# EAGLE design csa_pwr-v1.1c (EAGLE 5.11)
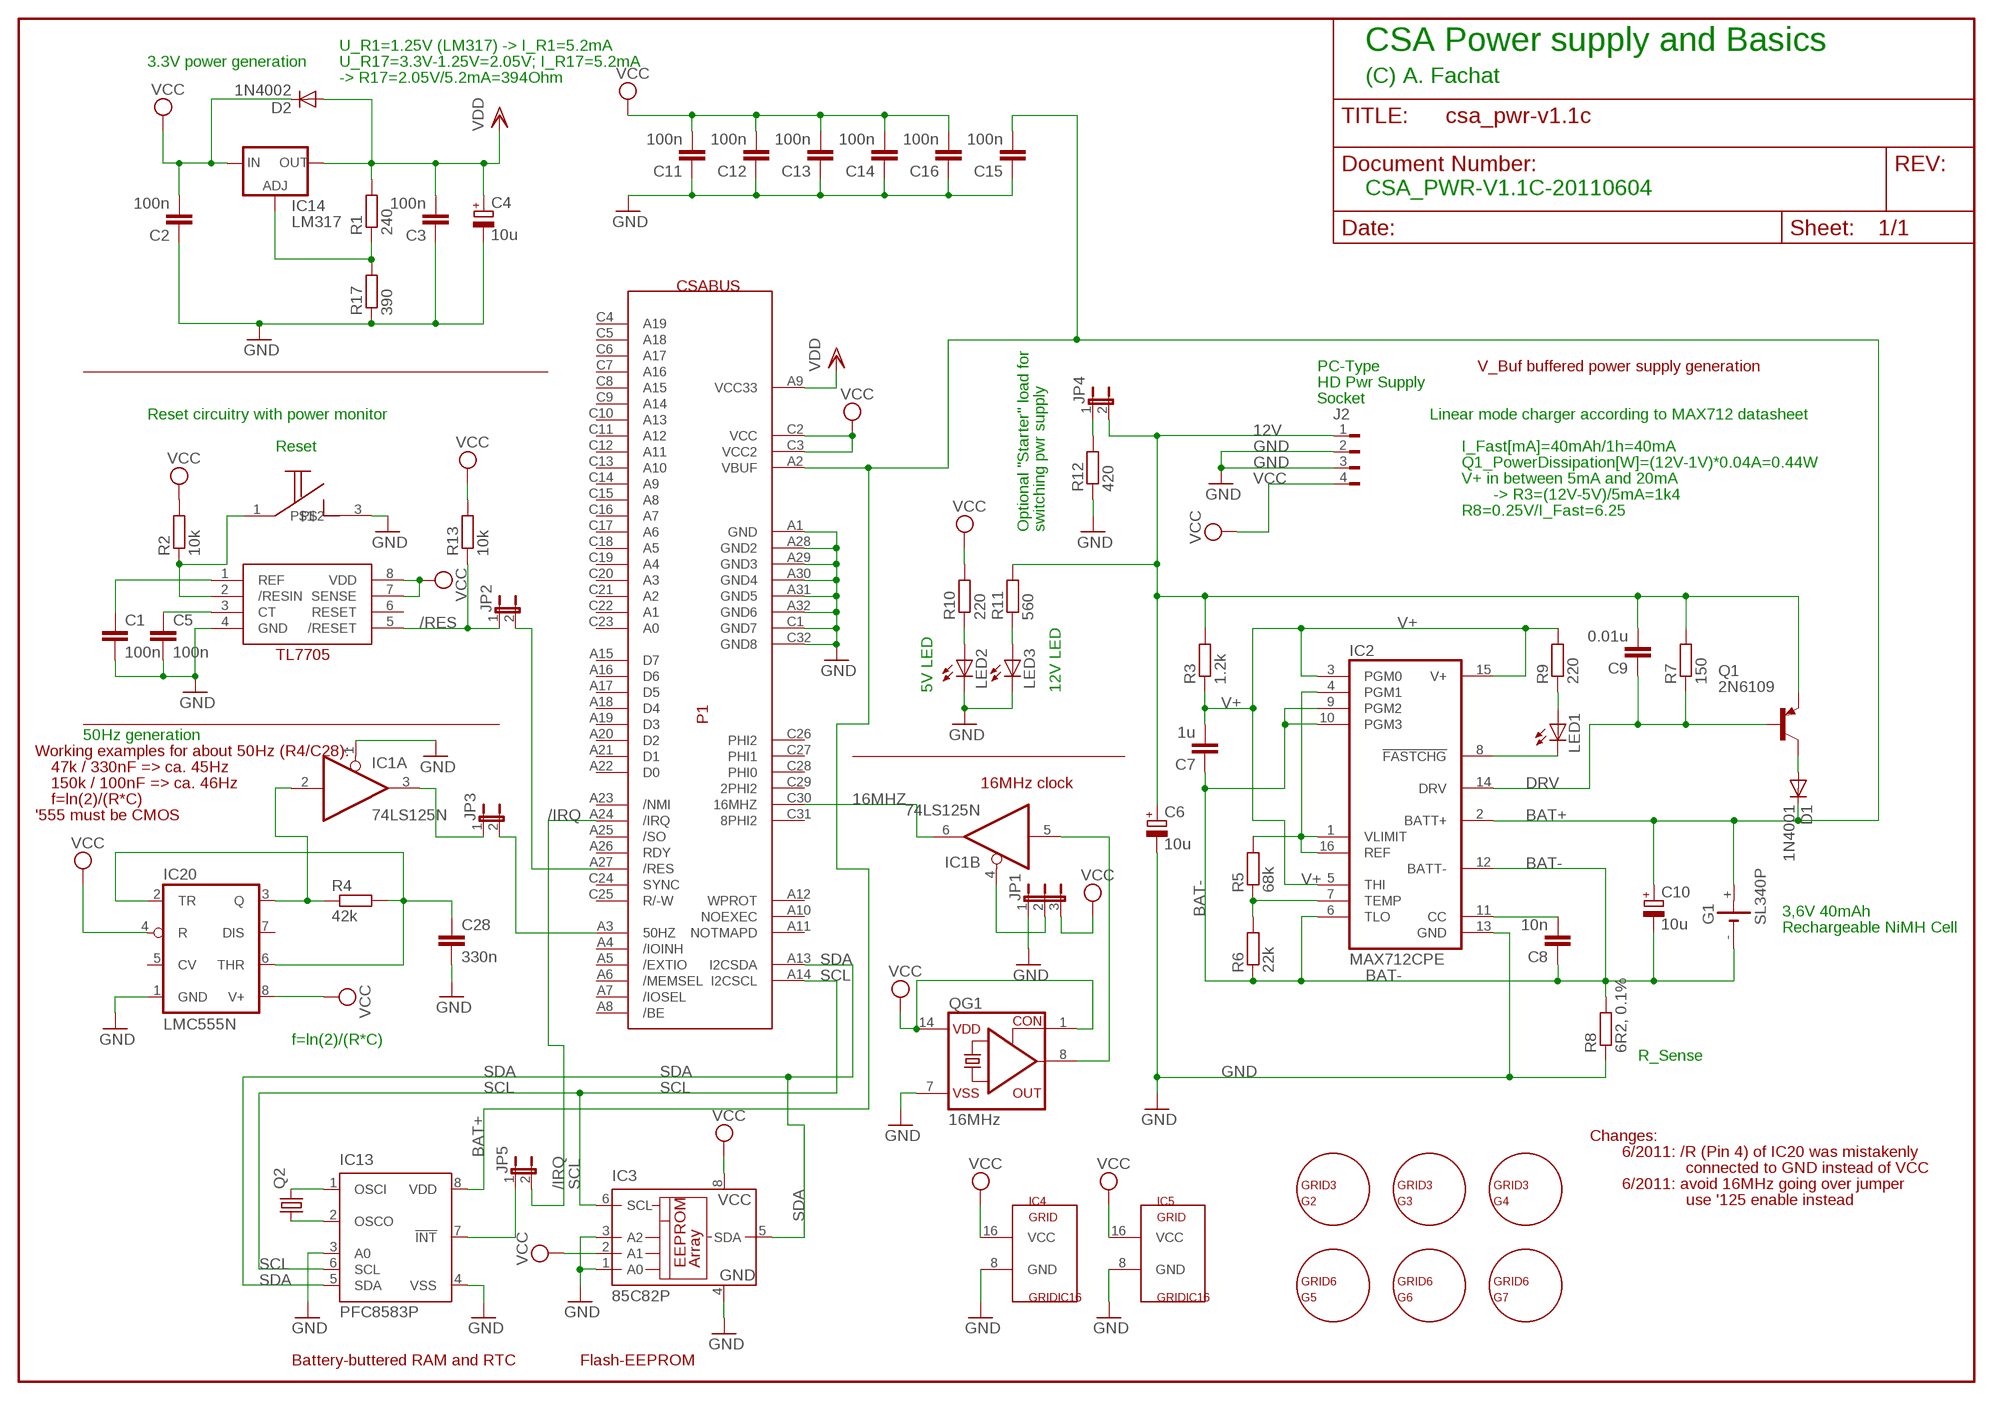
[diagram p0: schematic, sheet 1]

## Parts
C1  100n  C-EU025-025X050  [C025-025X050]
C2  100n  C5/2.5  [C5B2.5]
C3  100n  C5/2.5  [C5B2.5]
C4  10u  CPOL-EUE2-5  [E2-5]
C5  100n  C-EU025-025X050  [C025-025X050]
C6  10u  CPOL-EUE2-5  [E2-5]
C7  1u  C5/2.5  [C5B2.5]
C8  10n  C5/2.5  [C5B2.5]
C9  0.01u  C5/2.5  [C5B2.5]
C10  10u  CPOL-EUE2-5  [E2-5]
C11  100n  C5/2.5  [C5B2.5]
C12  100n  C5/2.5  [C5B2.5]
C13  100n  C5/2.5  [C5B2.5]
C14  100n  C5/2.5  [C5B2.5]
C15  100n  C5/2.5  [C5B2.5]
C16  100n  C5/2.5  [C5B2.5]
C28  330n  C-EU050-025X075  [C050-025X075]
D1  1N4001  DIODE-C1702-15  [C1702-15]
D2  1N4002  DIODE-C1702-15  [C1702-15]
G1  SL340P  [SL-340/P3.6V]
G2  GRID3  [GRID3]
G3  GRID3  [GRID3]
G4  GRID3  [GRID3]
G5  GRID6  [GRID6]
G6  GRID6  [GRID6]
G7  GRID6  [GRID6]
IC1  74LS125N  [DIL14]
IC2  MAX712CPE  [DIL16]
IC3  85C82P  [DIL8]
IC4  GRIDIC16  [GRIDIC8]
IC5  GRIDIC16  [GRIDIC8]
IC13  PFC8583P  [DIL08]
IC14  LM317  LM317TL  [317TL]
IC20  LMC555N  LM555N  [DIL08]
J2  FLOP-4W827001  [827001]
JP1  JP2E  [JP2]
JP2  JP1E  [JP1]
JP3  JP1E  [JP1]
JP4  JP1E  [JP1]
JP5  JP1E  [JP1]
LED1  LED3MM  [LED3MM]
LED2  LED3MM  [LED3MM]
LED3  LED3MM  [LED3MM]
P1  CSABUS  [CSABUS]
Q1  2N6109  2N6107  [TO220]
Q2  CRYTALHC49S  [HC49/S]
QG1  16MHz  CRYSTAL_RES-SG51  [SG51]
R1  240  R-EU_0204/5  [0204/5]
R2  10k  R-EU_0207/10  [0207/10]
R3  1.2k  R-EU_0204/5  [0204/5]
R4  42k  R-EU_0204/7  [0204/7]
R5  68k  R-EU_0204/5  [0204/5]
R6  22k  R-EU_0204/5  [0204/5]
R7  150  R-EU_0204/5  [0204/5]
R8  6R2, 0.1%  R-EU_0204/5  [0204/5]
R9  220  R-EU_0204/5  [0204/5]
R10  220  R-EU_0204/5  [0204/5]
R11  560  R-EU_0204/5  [0204/5]
R12  420  R-EU_RDH/15  [RDH/15]
R13  10k  R-EU_0207/10  [0207/10]
R17  390  R-EU_0204/5  [0204/5]
U$1  TL7705  [DIL08]
U$2  TASTER  [TASTER]

## Nets
12V: C6.+ C9.2 J2.1 JP4.2 Q1.3(E) R3.2 R7.2 R11.2
16MHZ: IC1.6(B:O) P1.C30(16MHZ)
/IRQ: JP5.2 P1.A24(/IRQ)
/RES: JP2.1 R13.1 U$1.5(/RESET)
BAT+: C10.+ C15.2 D1.C G1.+ IC2.2(BATT+) IC13.8(VDD) P1.A2(VBUF)
BAT-: C7.1 C8.1 C10.- G1.- IC2.6(TLO) IC2.9(PGM2) IC2.10(PGM3) IC2.12(BATT-) R6.1 R8.2
DRV: C9.1 IC2.14(DRV) Q1.1(B) R7.1
GND: C1.2 C2.1 C3.1 C4.- C5.2 C6.- C11.1 C12.1 C13.1 C14.1 C15.1 C16.1 C28.2 IC1.1(A:OE) IC2.13(GND) IC3.1(A0) IC3.3(A2) IC3.4(GND) IC4.8(GND) IC5.8(GND) IC13.3(A0) IC13.4(VSS) IC20.1(GND) J2.2 J2.3 JP1.1 LED2.K(C) LED3.K(C) P1.A1(GND) P1.A28(GND2) P1.A29(GND3) P1.A30(GND4) P1.A31(GND5) P1.A32(GND6) P1.C1(GND7) P1.C32(GND8) QG1.7(VSS) R8.1 R12.1 R17.1 U$1.4(GND) U$2.3
N$1: C5.1 U$1.3(CT)
N$2: IC14.1(ADJ) R1.1 R17.2
N$3: C1.1 U$1.1(REF)
N$4: JP3.2 P1.A3(50HZ)
N$5: IC1.5(B:I) QG1.8(OUT)
N$6: IC1.2(A:I) IC20.3(Q) R4.1
N$7: R2.1 U$1.2(/RESIN) U$2.1
N$8: JP2.2 P1.A27(/RES)
N$11: IC2.1(VLIMIT) IC2.4(PGM1) IC2.16(REF) R5.2
N$12: IC2.7(TEMP) R5.1 R6.2
N$13: LED1.A R9.1
N$14: IC2.8(!FASTCHG) LED1.K(C)
N$15: IC1.4(B:OE) JP1.2
N$16: C8.2 IC2.11(CC)
N$18: LED2.A R10.1
N$19: LED3.A R11.1
N$20: D1.A Q1.2(C)
N$21: JP4.1 R12.2
N$22: IC13.7(!INT) JP5.1
N$23: IC13.2(OSCO) Q2.1
N$24: IC13.1(OSCI) Q2.2
N$55: IC1.3(A:O) JP3.1
N$56: C28.1 IC20.2(TR) IC20.6(THR) R4.2
SCL: IC3.6(SCL) IC13.6(SCL) P1.A14(I2CSCL)
SDA: IC3.5(SDA) IC13.5(SDA) P1.A13(I2CSDA)
V+: C7.2 IC2.3(PGM0) IC2.5(THI) IC2.15(V+) R3.1 R9.2
VCC: C2.2 C11.2 C12.2 C13.2 C14.2 C16.2 D2.C IC3.2(A1) IC3.8(VCC) IC4.16(VCC) IC5.16(VCC) IC14.3(IN) IC20.4(R) IC20.8(V+) J2.4 JP1.3 P1.C2(VCC) P1.C3(VCC2) QG1.1(CON) QG1.14(VDD) R2.2 R10.2 R13.2 U$1.7(SENSE) U$1.8(VDD)
VDD: C3.2 C4.+ D2.A IC14.2(OUT) P1.A9(VCC33) R1.2
Unconnected: IC1.8(C:O) IC1.9(C:I) IC1.10(C:OE) IC1.11(D:O) IC1.12(D:I) IC1.13(D:OE) IC3.7(NC) IC20.5(CV) IC20.7(DIS) P1.A4(/IOINH) P1.A5(/EXTIO) P1.A6(/MEMSEL) P1.A7(/IOSEL) P1.A8(/BE) P1.A10(NOEXEC) P1.A11(NOTMAPD) P1.A12(WPROT) P1.A15(D7) P1.A16(D6) P1.A17(D5) P1.A18(D4) P1.A19(D3) P1.A20(D2) P1.A21(D1) P1.A22(D0) P1.A23(/NMI) P1.A25(/SO) P1.A26(RDY) P1.C4(A19) P1.C5(A18) P1.C6(A17) P1.C7(A16) P1.C8(A15) P1.C9(A14) P1.C10(A13) P1.C11(A12) P1.C12(A11) P1.C13(A10) P1.C14(A9) P1.C15(A8) P1.C16(A7) P1.C17(A6) P1.C18(A5) P1.C19(A4) P1.C20(A3) P1.C21(A2) P1.C22(A1) P1.C23(A0) P1.C24(SYNC) P1.C25(R/-W) P1.C26(PHI2) P1.C27(PHI1) P1.C28(PHI0) P1.C29(2PHI2) P1.C31(8PHI2) U$1.6(RESET)

## Notes on the sheet
- U_R1=1.25V (LM317) -> I_R1=5.2mA | CSA Power supply and Basics
- 3.3V power generation | U_R17=3.3V-1.25V=2.05V; I_R17=5.2mA
- -> R17=2.05V/5.2mA=394Ohm | (C) A. Fachat
- CSA_PWR-V1.1C-20110604
- PC-Type | V_Buf buffered power supply generation
- HD Pwr Supply
- Socket
- Reset circuitry with power monitor | Linear mode charger according to MAX712 datasheet
- Reset | I_Fast[mA]=40mAh/1h=40mA
- Q1_PowerDissipation[W]=(12V-1V)*0.04A=0.44W
- V+ in between 5mA and 20mA
- -> R3=(12V-5V)/5mA=1k4
- R8=0.25V/I_Fast=6.25
- Optional "Starter" load for | switching pwr supply
- 5V LED | 12V LED
- 50Hz generation
- Working examples for about 50Hz (R4/C28):
- 47k / 330nF => ca. 45Hz
- 150k / 100nF => ca. 46Hz | 16MHz clock
- f=ln(2)/(R*C)
- '555 must be CMOS
- 3,6V 40mAh
- Rechargeable NiMH Cell
- f=ln(2)/(R*C)
- R_Sense
- Changes:
- 6/2011: /R (Pin 4) of IC20 was mistakenly
- connected to GND instead of VCC
- 6/2011: avoid 16MHz going over jumper
- use '125 enable instead
- Battery-buttered RAM and RTC | Flash-EEPROM

## Power pins joined to a net without a drawn wire
GND: IC1.7(P:GND)
VCC: IC1.14(P:VCC)

## Library data of the parts
C1 C5 C28 = rcl:C-EU: CAPACITOR, European symbol
C2 C3 C7-C9 C11-C16 = capacitor-wima:C: CAPACITOR naming: grid - package width
C4 C6 C10 = rcl:CPOL-EU: POLARIZED CAPACITOR, European symbol
D1 D2 = diode:DIODE-: DIODE
G1 = battery:SL340P: LI BATTERY Sonnenschein SL-340 P 3.6 V
G2-G7 = csa:GRID
IC1 = 74xx-eu:74*125: Quad bus BUFFER, 3-state
IC2 = maxim:MAX71*?: NiCd/NiMH Battery Fast-Charge Controller
IC3 = microchip:85C*: Serial EEPROM 1 K/2 K/4 K, 5.0 V, CMOS 85C72/82/92
IC4 IC5 = csa:GRIDIC
IC13 = micro-philips:PFC8583: I2C-Bus CLOCK/CALENDAR
IC14 = v-reg:LM317TL: VOLTAGE REGULATOR
IC20 = linear:*555: TIMER
J2 = con-amp:FLOP-4W: MATE N-LOCK Floppy / HDD conector Distributor: Bürklin 71F972
JP1 = jumper:JP2E: JUMPER
JP2-JP5 = jumper:JP1E: JUMPER
LED1-LED3 = led:LED: LED OSRAM: - CHIPLED LG R971, LG N971, LY N971, LG Q971, LY Q971, LO R971, LY R971 LH N974, LH R974 LS Q976, LO Q976, LY Q976 LO Q996 - Hyper CHIPLED LW Q18S LB Q993, LB Q99A, LB R99A - SideLED LS A670, LO A670, LY A670, LG A670, LP A670 LB A673, LV A673, LT A673, LW A673 LH A674 LY A675 LS A676, LA A676, LO A676, LY A676, LW A676 LS A679, LY A679, LG A679 - Hyper Micro SIDELED® LS Y876, LA Y876, LO Y876, LY Y876 LT Y87S - SmartLED LW L88C, LW L88S LB L89C, LB L89S, LG L890 LS L89K, LO L89K, LY L89K LS L896, LA L896, LO L896, LY L896 - TOPLED LS T670, LO T670, LY T670, LG T670, LP T670 LSG T670, LSP T670, LSY T670, LOP T670, LYG T670 LG T671, LOG T671, LSG T671 LB T673, LV T673, LT T673, LW T673 LH T674 LS T676, LA T676, LO T676, LY T676, LB T676, LH T676, LSB T676, LW T676 LB T67C, LV T67C, LT T67C, LS T67K, LO T67K, LY T67K, LW E67C LS E67B, LA E67B, LO E67B, LY E67B, LB E67C, LV E67C, LT E67C LW T67C LS T679, LY T679, LG T679 LS T770, LO T770, LY T770, LG T770, LP T770 LB T773, LV T773, LT T773, LW T773 LH T774 LS E675, LA E675, LY E675, LS T675 LS T776, LA T776, LO T776, LY T776, LB T776 LHGB T686 LT T68C, LB T68C - Hyper Mini TOPLED® LB M676 - Mini TOPLED Santana® LG M470 LS M47K, LO M47K, LY M47K Source: http://www.osram.convergy.de/
P1 = csa:CSABUS
Q1 = transistor-pnp:2N6107: PNP Transistor
Q2 = crystal:CRYTAL: CRYSTAL
QG1 = crystal:CRYSTAL_RES-: CRYSTAL RESONATOR
R1-R13 R17 = rcl:R-EU_: RESISTOR, European symbol
U$1 = csa:TL7705
U$2 = csa:TASTER

## Board
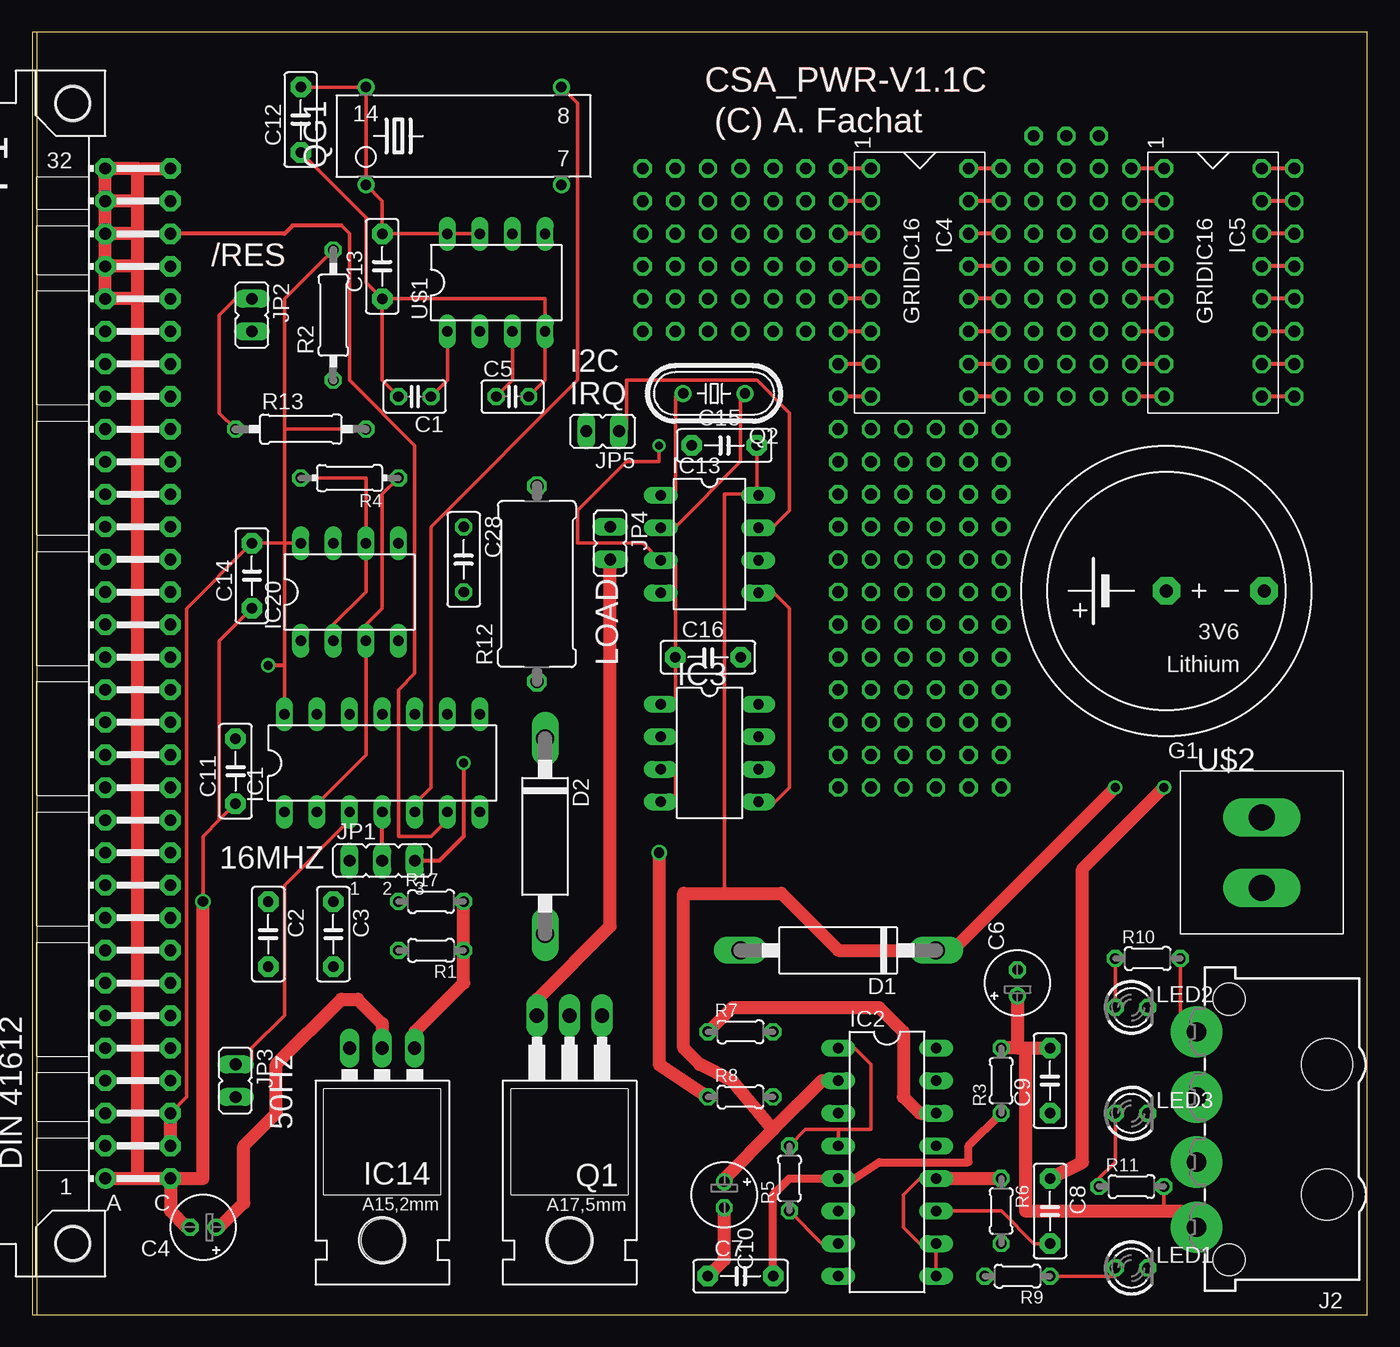
[diagram p1: board, top side]
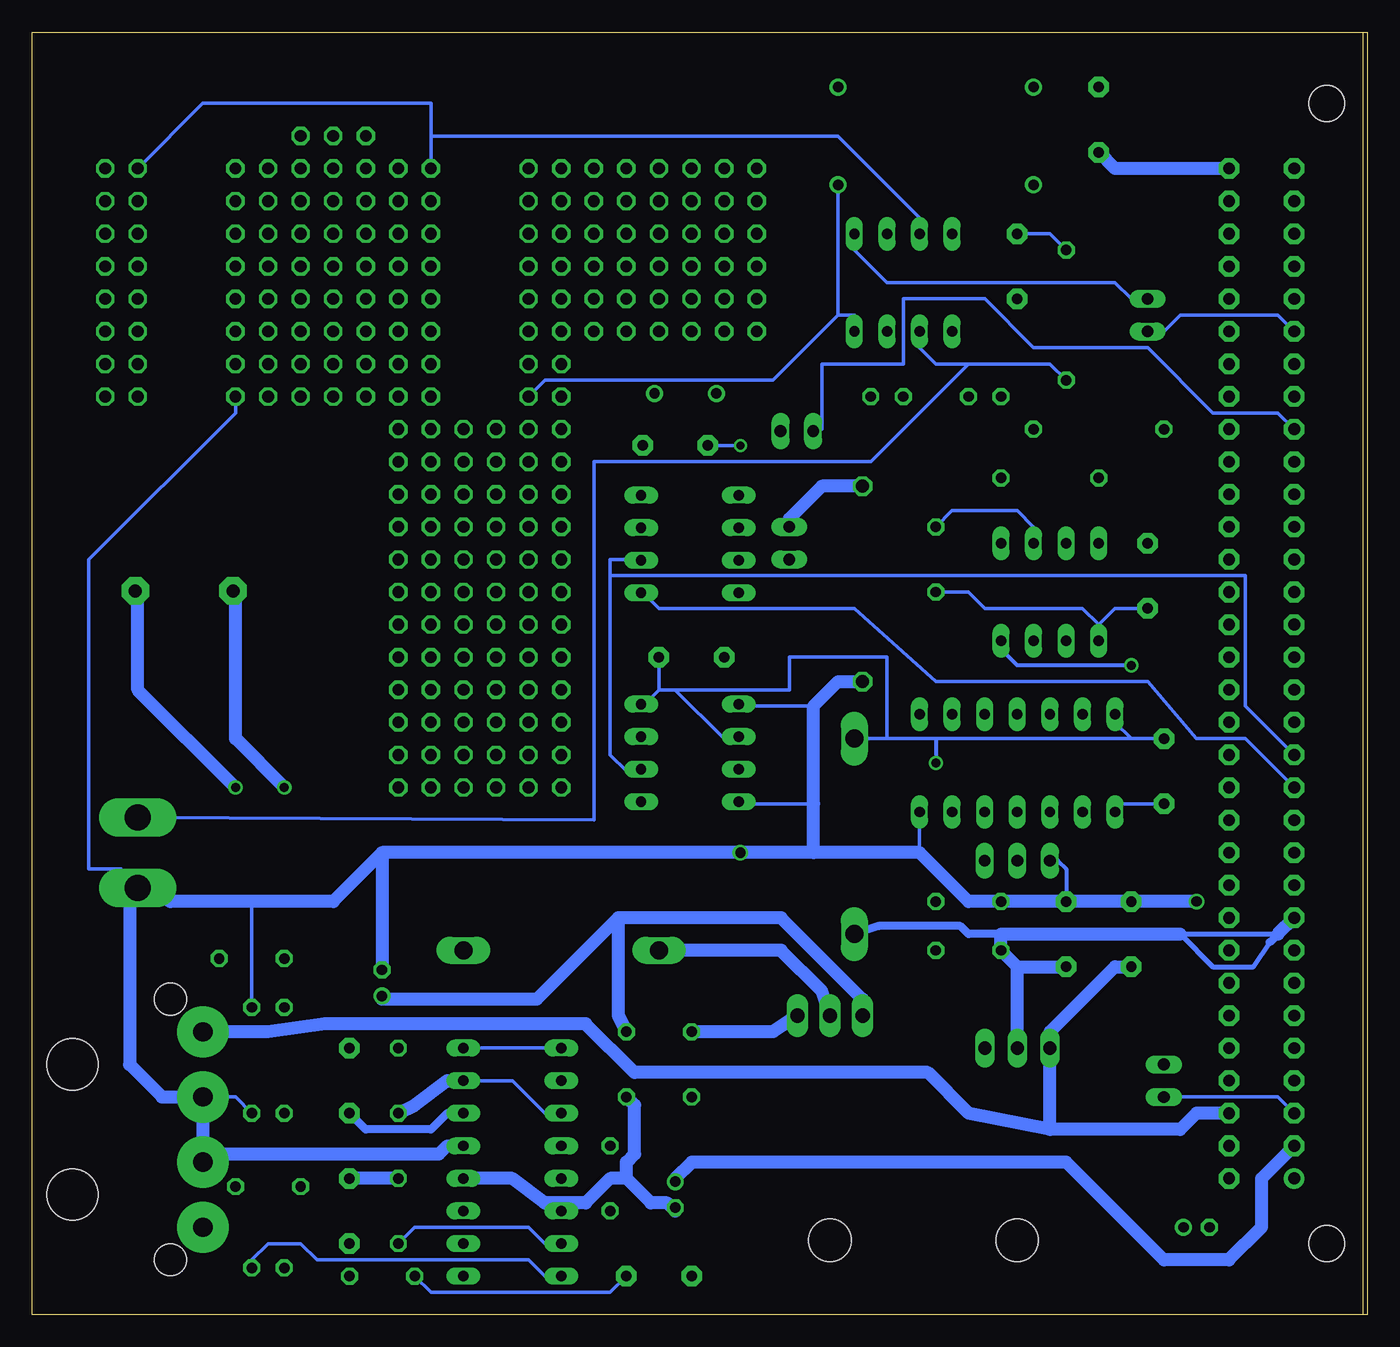
[diagram p2: board, bottom side, seen from below]

Size 104.12 x 100.03 mm. Coordinates in mm from the lower left corner, seen from the top.
Outline: 0,0.01 104.12,0.01 104.12,100.01 0,100.01 0,0.01
Copper layers (1*16): Top 0.035mm / dielectric 1.5mm / Bottom 0.035mm
Design rules "default": minimum track width 10mil, minimum drill 24mil, track to track 8mil, track to pad 8mil, pad to pad 8mil, via to via 8mil, smd to smd 8mil, copper to edge 40mil, drill to drill 8mil, minimum pad ring 10mil, minimum via ring 8mil, stop-mask expansion 4mil, vias tented up to drill 0mil, thermal gap 10mil

### Footprints (pad centres in the part's own frame; a part is rotated, then mirrored left to right if it is on the bottom)
C025-025X050 = drill 0.813 octagon: 1 -1.27,0; 2 1.27,0
C5B2.5 = drill 0.813 pad 1.6 octagon: 1 -2.54,0; 2 2.54,0
E2-5 = drill 0.813 pad 1.27 round: + -1.016,0 | drill 0.813 pad 1.27 octagon: - 1.016,0
C050-025X075 = drill 0.813 octagon: 1 -2.54,0; 2 2.54,0
C1702-15 = drill 1.397 long: A 7.62,0; C -7.62,0
SL-340/P3.6V = drill 1.016 pad 2.159 octagon: + 0,0; - -7.62,0
GRID3 = drill 0.914 octagon: 1 -2.54,2.54; 2 0,2.54; 3 2.54,2.54; 13 -2.54,-2.54; 14 0,-2.54; 15 2.54,-2.54; A2 -2.54,0; B2 0,0; C2 2.54,0
GRID6 = drill 0.914 octagon: 1 -6.35,-1.27; 2 -3.81,-1.27; 3 -1.27,-1.27; 4 1.27,-1.27; 5 3.81,-1.27; 6 6.35,-1.27; 7 -6.35,3.81; 8 -3.81,3.81; 9 -1.27,3.81; 10 1.27,3.81; 11 3.81,3.81; 12 6.35,3.81; 13 -6.35,-6.35; 14 -3.81,-6.35; 15 -1.27,-6.35; 16 1.27,-6.35; 17 3.81,-6.35; 18 6.35,-6.35; A -6.35,1.27; A1 -6.35,6.35; A2 -6.35,-3.81; B -3.81,1.27; B1 -3.81,6.35; B2 -3.81,-3.81; C -1.27,1.27; C1 -1.27,6.35; C2 -1.27,-3.81; D 1.27,1.27; D1 1.27,6.35; D2 1.27,-3.81; E 3.81,1.27; E1 3.81,6.35; E2 3.81,-3.81; F 6.35,1.27; F1 6.35,6.35; F2 6.35,-3.81
DIL14 = drill 0.813 long: 1 -7.62,-3.81; 2 -5.08,-3.81; 3 -2.54,-3.81; 4 0,-3.81; 5 2.54,-3.81; 6 5.08,-3.81; 7 7.62,-3.81; 8 7.62,3.81; 9 5.08,3.81; 10 2.54,3.81; 11 0,3.81; 12 -2.54,3.81; 13 -5.08,3.81; 14 -7.62,3.81
DIL16 = drill 0.813 long: 1 -8.89,-3.81; 2 -6.35,-3.81; 3 -3.81,-3.81; 4 -1.27,-3.81; 5 1.27,-3.81; 6 3.81,-3.81; 7 6.35,-3.81; 8 8.89,-3.81; 9 8.89,3.81; 10 6.35,3.81; 11 3.81,3.81; 12 1.27,3.81; 13 -1.27,3.81; 14 -3.81,3.81; 15 -6.35,3.81; 16 -8.89,3.81
DIL8 = drill 0.813 long: 1 -3.81,-3.81; 2 -1.27,-3.81; 3 1.27,-3.81; 4 3.81,-3.81; 5 3.81,3.81; 6 1.27,3.81; 7 -1.27,3.81; 8 -3.81,3.81
GRIDIC8 = drill 0.914 octagon: 1 -8.89,-3.81; 1@1 -8.89,-6.35; 2 -6.35,-3.81; 2@1 -6.35,-6.35; 3 -3.81,-3.81; 3@1 -3.81,-6.35; 4 -1.27,-3.81; 4@1 -1.27,-6.35; 5 1.27,-3.81; 5@1 1.27,-6.35; 6 3.81,-3.81; 6@1 3.81,-6.35; 7 6.35,-3.81; 7@1 6.35,-6.35; 8 8.89,-3.81; 8@1 8.89,-6.35; 9 8.89,3.81; 9@1 8.89,6.35; 10 6.35,3.81; 10@1 6.35,6.35; 11 3.81,3.81; 11@1 3.81,6.35; 12 1.27,3.81; 12@1 1.27,6.35; 13 -1.27,3.81; 13@1 -1.27,6.35; 14 -3.81,3.81; 14@1 -3.81,6.35; 15 -6.35,3.81; 15@1 -6.35,6.35; 16 -8.89,3.81; 16@1 -8.89,6.35
DIL08 = drill 0.813 long: 1 -3.81,-3.81; 2 -1.27,-3.81; 3 1.27,-3.81; 4 3.81,-3.81; 5 3.81,3.81; 6 1.27,3.81; 7 -1.27,3.81; 8 -3.81,3.81
317TL = drill 1.016 long: 1 -2.54,-3.81; 2 0,-3.81; 3 2.54,-3.81 | hole 3.302: 0,11.176
827001 = drill 1.5 pad 4 round: 1 -7.62,0; 2 -2.54,0; 3 2.54,0; 4 7.62,0 | hole 4: 5.08,-10.16; -5.08,-10.16 | hole 2.5: 10.16,-2.54; -10.16,-2.54
JP2 = drill 0.914 long: 1 -2.54,0; 2 0,0; 3 2.54,0
JP1 = drill 0.914 long: 1 0,-1.27; 2 0,1.27
LED3MM = drill 0.813 octagon: A -1.27,0; K 1.27,0
CSABUS = drill 0.914 pad 1.6 round: A1 7.62,36.83 | drill 0.914 pad 1.6 octagon: A2 7.62,34.29; A3 7.62,31.75; A4 7.62,29.21; A5 7.62,26.67; A6 7.62,24.13; A7 7.62,21.59; A8 7.62,19.05; A9 7.62,16.51; A10 7.62,13.97; A11 7.62,11.43; A12 7.62,8.89; A13 7.62,6.35; A14 7.62,3.81; A15 7.62,1.27; A16 7.62,-1.27; A17 7.62,-3.81; A18 7.62,-6.35; A19 7.62,-8.89; A20 7.62,-11.43; A21 7.62,-13.97; A22 7.62,-16.51; A23 7.62,-19.05; A24 7.62,-21.59; A25 7.62,-24.13; A26 7.62,-26.67; A27 7.62,-29.21; A28 7.62,-31.75; A29 7.62,-34.29; A30 7.62,-36.83; A31 7.62,-39.37; A32 7.62,-41.91; C1 2.54,36.83; C2 2.54,34.29; C3 2.54,31.75; C4 2.54,29.21; C5 2.54,26.67; C6 2.54,24.13; C7 2.54,21.59; C8 2.54,19.05; C9 2.54,16.51; C10 2.54,13.97; C11 2.54,11.43; C12 2.54,8.89; C13 2.54,6.35; C14 2.54,3.81; C15 2.54,1.27; C16 2.54,-1.27; C17 2.54,-3.81; C18 2.54,-6.35; C19 2.54,-8.89; C20 2.54,-11.43; C21 2.54,-13.97; C22 2.54,-16.51; C23 2.54,-19.05; C24 2.54,-21.59; C25 2.54,-24.13; C26 2.54,-26.67; C27 2.54,-29.21; C28 2.54,-31.75; C29 2.54,-34.29; C30 2.54,-36.83; C31 2.54,-39.37; C32 2.54,-41.91 | hole 2.794: 10.16,41.91; 10.16,-46.99
TO220 = drill 1.118 long: 1 -2.54,-6.35; 2 0,-6.35; 3 2.54,-6.35 | hole 3.302: 0,11.176
HC49/S = drill 0.813 round: 1 -2.413,0; 2 2.413,0
SG51 = drill 0.813 round: 1 -7.62,-3.81; 7 7.62,-3.81; 8 7.62,3.81; 14 -7.62,3.81
0204/5 = drill 0.813 octagon: 1 -2.54,0; 2 2.54,0
0207/10 = drill 0.813 octagon: 1 -5.08,0; 2 5.08,0
0204/7 = drill 0.813 octagon: 1 -3.81,0; 2 3.81,0
RDH/15 = drill 1.016 octagon: 1 -7.62,0; 2 7.62,0
DIL08' = drill 0.813 long: 1 -11.43,-2.54; 2 -8.89,-2.54; 3 -6.35,-2.54; 4 -3.81,-2.54; 5 -3.81,5.08; 6 -6.35,5.08; 7 -8.89,5.08; 8 -11.43,5.08
TASTER = drill 2.007 long: 1 0,4.013; 3 0,-1.473

### Placement (x,y rotation side)
C1  29.84,71.6 180 top
C2  18.41,29.69 270 top
C3  23.49,29.69 270 top
C4  13.33,6.83 180 top
C5  37.46,71.6 0 top
C6  76.83,25.88 90 top
C7  55.24,3.02 0 top
C8  79.37,8.1 270 top
C9  79.37,18.26 90 top
C10  53.97,9.37 270 top
C11  15.87,42.39 90 top
C12  20.95,93.19 90 top
C13  27.3,81.76 90 top
C14  17.14,57.63 90 top
C15  53.97,67.79 0 top
C16  52.7,51.28 0 top
C28  33.65,58.9 270 top
D1  62.86,28.42 180 top
D2  40,37.31 270 top
G1  88.45,56.45 180 top
G2  80.64,89.38 0 top
G3  80.64,81.76 0 top
G4  80.64,74.14 0 top
G5  69.21,62.71 0 top
G6  69.21,47.47 0 top
G7  53.97,83.03 0 top
IC1  27.3,43.03 0 top
IC2  66.67,11.91 270 top
IC3  52.83,43.81 270 top
IC4  69.21,80.49 270 top
IC5  92.07,80.49 270 top
IC13  52.83,60.11 270 top
IC14  27.3,16.99 180 top
IC20  24.76,56.36 0 top
J2  90.8,14.45 90 top
JP1  27.3,35.41 0 top
JP2  17.14,77.95 180 top
JP3  15.87,18.26 180 top
JP4  45.08,60.17 180 top
JP5  44.49,68.91 90 top
LED1  85.72,3.66 0 top
LED2  85.72,23.98 0 top
LED3  85.72,15.72 0 top
P1  13.33,47.47 180 top
Q1  41.91,16.99 180 top
Q2  53.18,71.84 180 top
QG1  33.65,91.92 0 top
R1  31.11,28.42 180 top
R2  23.49,77.95 90 top
R3  75.56,18.26 90 top
R4  24.76,65.25 180 top
R5  59.05,10.64 90 top
R6  75.56,8.1 270 top
R7  55.24,22.07 0 top
R8  55.24,16.99 0 top
R9  76.83,3.02 180 top
R10  86.99,27.79 0 top
R11  85.72,10.01 0 top
R12  39.37,57 90 top
R13  20.95,69.06 0 top
R17  31.11,32.23 0 top
U$1  TL7705  [DIL08']  43.81,79.22 0 top
U$2  95.88,34.77 0 top

### Tracks (layer width: path | path; a pad name or v marks a point on that pad's centre or on a via)
12V
  Top 0.254: 88.26,8.1 R11.2
  Top 1.016: 77.46,20.8 C9.2 | 76.83,20.8 77.46,20.8 | 76.83,20.8 R3.2 | 77.46,20.8 77.46,8.1 88.26,8.1 89.53,8.1 J2.1 | C6.+ 76.83,20.8 | JP4.2 45.08,30.33 39.37,24.61 Q1.3
  Bottom 0.254: 76.83,24.61 C6.+
  Bottom 1.016: 58.41,30.96 64.77,24.61 76.83,24.61 | 58.41,30.96 45.72,30.96 39.37,24.61 Q1.3 | 58.41,30.96 58.41,23.34 R7.2
16MHZ
  Top 0.254: 24.12,84.94 24.76,84.3 24.76,72.87 29.84,67.79 29.84,50.01 28.57,48.74 28.57,37.31 31.11,37.31 32.38,38.58 IC1.6
  Top 0.305: 24.12,84.94 20.31,84.94 19.68,84.3 P1.C30
/IRQ
  Bottom 0.254: P1.A24 6.98,70.33 12.06,70.33 17.14,75.41 26.03,75.41 29.84,79.22 36.19,79.22 36.19,74.14 42.54,74.14 42.54,69.06 JP5.2
/RES
  Top 0.254: R13.1 14.6,70.33 14.6,77.95 15.87,79.22 JP2.1
  Bottom 0.254: U$1.5 40,83.03 37.46,80.49 19.68,80.49 18.41,79.22 JP2.1
BAT+  (via drill 0.7)
  Top 0.254: 56.51,63.98 53.97,63.98 53.97,32.87 | 56.51,63.98 C15.2 | 56.51,63.98 IC13.8
  Top 1.016: 57.78,14.45 61.59,18.26 IC2.2 | 57.78,14.45 54.61,18.26 52.07,19.53 50.8,20.8 50.8,32.87 53.97,32.87 58.41,32.87 62.86,28.42 D1.C 71.75,28.42 v84.45,41.12 | C10.+ 53.97,10.64 57.78,14.45
  Bottom 1.016: P1.A2 8.25,10.64 8.25,6.83 10.79,4.29 15.87,4.29 23.49,11.91 52.7,11.91 53.97,10.64 C10.+ | v84.45,41.12 88.26,44.93 88.26,56.36 88.35,56.45 G1.+
BAT-  (via drill 0.7)
  Top 0.254: IC2.9 IC2.10 69.21,5.56 67.94,6.83 67.94,9.37 69.21,10.64 IC2.12
  Top 1.016: IC2.12 R6.1 | C8.1 81.91,11.91 81.91,34.77 v88.26,41.12 | C7.1 53.97,4.29 C10.-
  Bottom 0.254: 62.86,8.74 IC2.6
  Bottom 1.016: IC2.12 66.67,10.64 64.13,8.74 62.86,8.74 60.96,8.74 59.05,10.64 57.78,10.64 | R6.1 C8.1 | 57.78,10.64 55.88,8.74 54.61,8.74 53.97,8.1 C10.- | 57.78,10.64 57.78,11.91 57.15,12.55 57.15,16.36 R8.2 | v88.26,41.12 95.88,48.74 95.88,56.36 95.97,56.45 G1.-
DRV
  Top 1.016: R7.1 54.61,23.98 66.03,23.98 67.94,22.07 67.94,16.99 69.21,15.72 IC2.14
  Bottom 0.61: C9.1 78.1,14.45 73.02,14.45 71.75,15.72 IC2.14
  Bottom 1.016: R7.1 46.35,22.07 Q1.1
GND  (via drill 0.61, 0.8)
  Top 0.254: C1.2 27.3,72.87 C13.1 | C5.2 40,72.87 U$1.4 40,79.22 C13.1 | C12.1 26.03,85.57 26.03,80.49 C13.1 | 12.06,6.83 C4.- | v13.33,32.23 13.33,37.31 14.6,38.58 | 14.6,38.58 C11.1 | C14.1 14.6,52.55 14.6,38.58 | 50.16,56.36 50.16,58.9 IC13.3 48.89,58.9 47.62,60.17 42.54,60.17 42.54,62.71 46.35,66.52 48.89,66.52 v48.89,67.79 | IC3.4 50.16,39.85 50.16,42.39 IC3.3 | IC3.1 50.16,47.47 C16.1 50.16,56.36 | 50.16,56.36 IC13.4
  Top 1.016: P1.A29 P1.A28 8.25,79.22 | P1.A30 P1.A31 | P1.A31 P1.A32 8.25,89.38 | 8.25,89.38 P1.C32 | P1.A29 P1.A30 | 12.06,6.83 10.79,8.1 P1.C1 | P1.A1 8.25,10.64 | 8.25,10.64 P1.C1 | v48.89,36.04 48.89,19.53 R8.1 | P1.C1 13.33,10.64 v13.33,32.23 | 8.25,86.84 8.25,89.38 | 8.25,84.3 8.25,86.84 | 8.25,81.76 8.25,84.3 | 8.25,79.22 8.25,81.76 | 8.25,10.64 8.25,79.22 | 8.25,81.76 P1.A29 | 8.25,84.3 P1.A30 | 8.25,86.84 P1.A31
  Bottom 0.254: 20.95,53.82 19.68,55.09 C14.1 | C28.2 31.11,56.36 29.84,55.09 22.22,55.09 20.95,53.82 | 20.95,53.82 IC20.1 | 41.27,77.95 QG1.7 | 41.27,77.95 40,77.95 U$1.4 | J2.2 90.8,12.55 | 89.53,18.26 J2.3 88.26,16.99 LED3.K | 76.83,27.15 C6.- | 86.99,32.23 LED2.K | C11.1 19.68,39.85 IC1.1 | 34.92,36.04 IC1.7 | IC3.4 48.89,39.85 43.18,39.85 | IC4.8 64.13,72.87 46.35,72.87 41.27,77.95 | IC5.8 88.26,70.33 99.69,58.9 99.69,34.77 97.15,34.77 U$2.3 | v48.89,67.79 C15.1 | IC3.1 48.89,47.47 43.18,47.47
  Bottom 0.305: JP1.1 24.12,35.41 23.49,34.77 C3.1
  Bottom 1.016: C12.1 19.68,89.38 P1.C32 | 90.8,12.55 72.38,12.55 71.75,13.18 IC2.13 | v13.33,32.23 C2.1 C3.1 R17.1 31.11,32.23 34.92,36.04 43.18,36.04 | 76.83,36.04 76.83,27.15 | 43.18,36.04 v48.89,36.04 76.83,36.04 | 76.83,36.04 80.64,32.23 86.99,32.23 93.34,32.23 U$2.3 95.88,33.5 96.52,32.87 96.52,19.53 93.97,16.99 J2.3 J2.2 | R12.1 41.27,49.38 43.18,47.47 43.18,39.85 43.18,36.04
N$1
  Top 0.254: C5.1 37.46,72.87 U$1.3
N$2
  Top 1.016: R17.2 R1.1 33.65,25.88 29.84,22.07 IC14.1
N$3
  Top 0.254: C1.1 32.38,72.87 U$1.1
N$4
  Bottom 0.254: P1.A3 6.98,16.99 JP3.2
N$5
  Top 0.254: QG1.8 42.54,94.46 42.54,72.87 31.11,61.44 31.11,41.12 29.84,39.85 IC1.5
N$6
  Top 0.254: R4.1 27.3,63.98 27.3,55.09 26.03,53.82 IC20.3 26.03,43.66 22.22,39.85 IC1.2
N$7
  Bottom 0.254: R2.1 24.76,74.14 31.11,74.14 | 31.11,74.14 33.65,74.14 34.92,75.41 U$1.2 | 31.11,74.14 38.73,66.52 60.32,66.52 60.32,38.58 U$2.1
N$8
  Bottom 0.254: P1.A27 6.98,77.95 14.6,77.95 15.87,76.68 JP2.2
N$11
  Top 0.254: R5.2 60.32,14.45 62.86,14.45 | 62.86,14.45 65.4,14.45 65.4,19.53 64.13,20.8 IC2.1 | 62.86,14.45 IC2.4
  Bottom 0.254: IC2.1 IC2.16
N$12
  Top 0.254: R5.1 61.59,5.56 IC2.7
  Bottom 0.254: R6.2 74.29,6.83 65.4,6.83 64.13,5.56 IC2.7
N$13
  Top 0.254: R9.1 84.45,3.02 LED1.A
N$14
  Bottom 0.254: IC2.8 64.13,3.02 65.4,4.29 81.91,4.29 83.18,5.56 85.72,5.56 86.99,4.29 LED1.K
N$15
  Top 0.305: JP1.2 IC1.4
N$16
  Top 0.254: C8.2 78.1,5.56 75.56,8.1 IC2.11
N$18
  Top 0.254: LED2.A R10.1
N$19
  Top 0.254: LED3.A 84.45,11.91 83.18,10.64 R11.1
N$20
  Bottom 1.016: Q1.2 42.54,25.25 45.72,28.42 D1.A
N$21
  Bottom 1.016: JP4.1 45.08,62.08 42.54,64.62 R12.2
N$22
  Top 0.254: IC13.7 57.78,61.44 59.05,62.71 59.05,70.33 56.51,72.87 46.35,72.87 46.35,69.06 JP5.1
N$23
  Top 0.254: IC13.2 50.16,61.44 55.24,66.52 55.24,71.6 Q2.1
N$24
  Top 0.254: IC13.1 50.16,63.98 50.16,71.6 Q2.2
N$55
  Top 0.254: IC1.3 24.76,38.58 19.68,33.5 19.68,23.34 17.14,20.8 17.14,19.53 JP3.1
N$56
  Top 0.254: IC20.2 23.49,53.82 26.03,56.36 IC20.6 26.03,65.25 R4.2
  Bottom 0.254: C28.1 32.38,62.71 27.3,62.71 26.03,61.44 IC20.6
SCL
  Bottom 0.254: 59.05,57.63 59.05,58.9 57.78,58.9 IC13.6 | 59.05,57.63 59.05,43.66 57.78,42.39 IC3.6 | P1.A14 9.52,47.47 9.52,57.63 59.05,57.63
SDA
  Top 0.254: IC3.5 57.78,39.85 59.05,41.12 59.05,55.09 57.78,56.36 IC13.5
  Bottom 0.254: P1.A13 9.52,44.93 13.33,44.93 17.14,49.38 33.65,49.38 40,55.09 55.24,55.09 56.51,56.36 IC13.5
V+
  Top 0.254: IC2.5 64.13,10.64
  Top 0.61: C7.2 57.78,9.37 59.05,10.64 IC2.5 | R3.1 73.02,13.18 73.02,11.91 66.03,11.91 64.13,10.64
  Bottom 0.254: IC2.3 64.13,15.72 66.67,18.26 IC2.15 | R9.2 73.02,1.75 59.05,1.75 C7.2
  Bottom 1.016: R3.1 74.29,16.36 71.75,18.26 IC2.15
VCC  (via drill 0.7)
  Top 0.254: C12.2 QG1.14 QG1.1 27.3,86.84 C13.2 U$1.8 U$1.7 | 19.68,60.17 C14.2 12.06,55.09 12.06,16.99 P1.C3 | 19.68,60.17 IC20.8 | R2.2 19.68,79.22 19.68,69.06 | 19.68,60.17 19.68,69.06 | R10.2 89.53,23.34 J2.4 | 19.68,60.17 19.68,50.65 IC1.14 | 19.68,69.06 R13.2
  Top 0.305: 19.68,50.65 v18.41,50.65 | JP1.3 31.74,35.41 33.65,37.31 v33.65,43.03
  Top 1.016: P1.C2 P1.C3
  Bottom 0.254: R2.2 24.76,84.3 C13.2 | 18.41,44.93 19.68,46.2 IC1.14 | 18.41,44.93 C11.2 | 18.41,44.93 33.65,44.93 37.46,44.93 | 37.46,44.93 D2.C | 55.24,48.74 56.51,47.47 IC3.8 | 53.97,48.74 45.08,48.74 45.08,51.28 37.46,51.28 37.46,44.93 | 53.97,48.74 55.24,48.74 | 73.02,91.92 73.02,94.46 90.8,94.46 IC5.16 | 73.02,91.92 IC4.16 | 73.02,91.92 41.27,91.92 34.92,85.57 U$1.7 | 55.24,48.74 C16.2 | 53.97,48.74 50.16,44.93 IC3.2
  Bottom 0.305: IC20.4 28.57,51.92 27.3,50.65 v18.41,50.65 | 33.65,44.93 v33.65,43.03
  Bottom 1.016: C2.2 19.68,27.15 24.76,22.07 IC14.3 24.76,14.45 | P1.C3 13.33,15.72 14.6,14.45 24.76,14.45 | J2.4 85.72,22.07 81.27,22.71 60.96,22.71 57.15,18.9 34.29,18.9 31.11,15.72 24.76,14.45
VDD
  Top 0.254: C4.+ 14.6,6.83
  Top 1.016: 14.6,6.83 16.5,8.74 16.5,13.18 19.04,15.72 19.04,19.53 24.12,24.61 25.39,24.61 27.3,22.71 IC14.2
  Bottom 0.406: 7.62,29.06 8.89,27.15 12.06,27.15 14.6,29.69 6.98,29.69
  Bottom 0.61: 28.57,29.69 31.11,29.69 31.74,30.33 38.1,30.33 D2.A | 6.98,29.69 7.62,29.06
  Bottom 1.016: 27.3,27.15 R1.2 28.57,29.69 14.6,29.69 | 27.3,27.15 C3.2 | 6.98,29.69 P1.A9 | IC14.2 27.3,27.15

### Text on the board
Top: CSA_PWR-V1.1C | (C) A. Fachat | /RES
tNames: CSA_PWR-V1.1C | (C) A. Fachat | /RES | I2C | IRQ | LOAD | 16MHZ | 50Hz